# Altium schematic sheet schematic_industrial controller board.SchDoc: Industerial controller
size B; ApprovedBy: abbas; CheckedBy: abbas; Author: abbas; Revision: V1.0; SheetNumber: 1; SheetTotal: 1; Size: A4
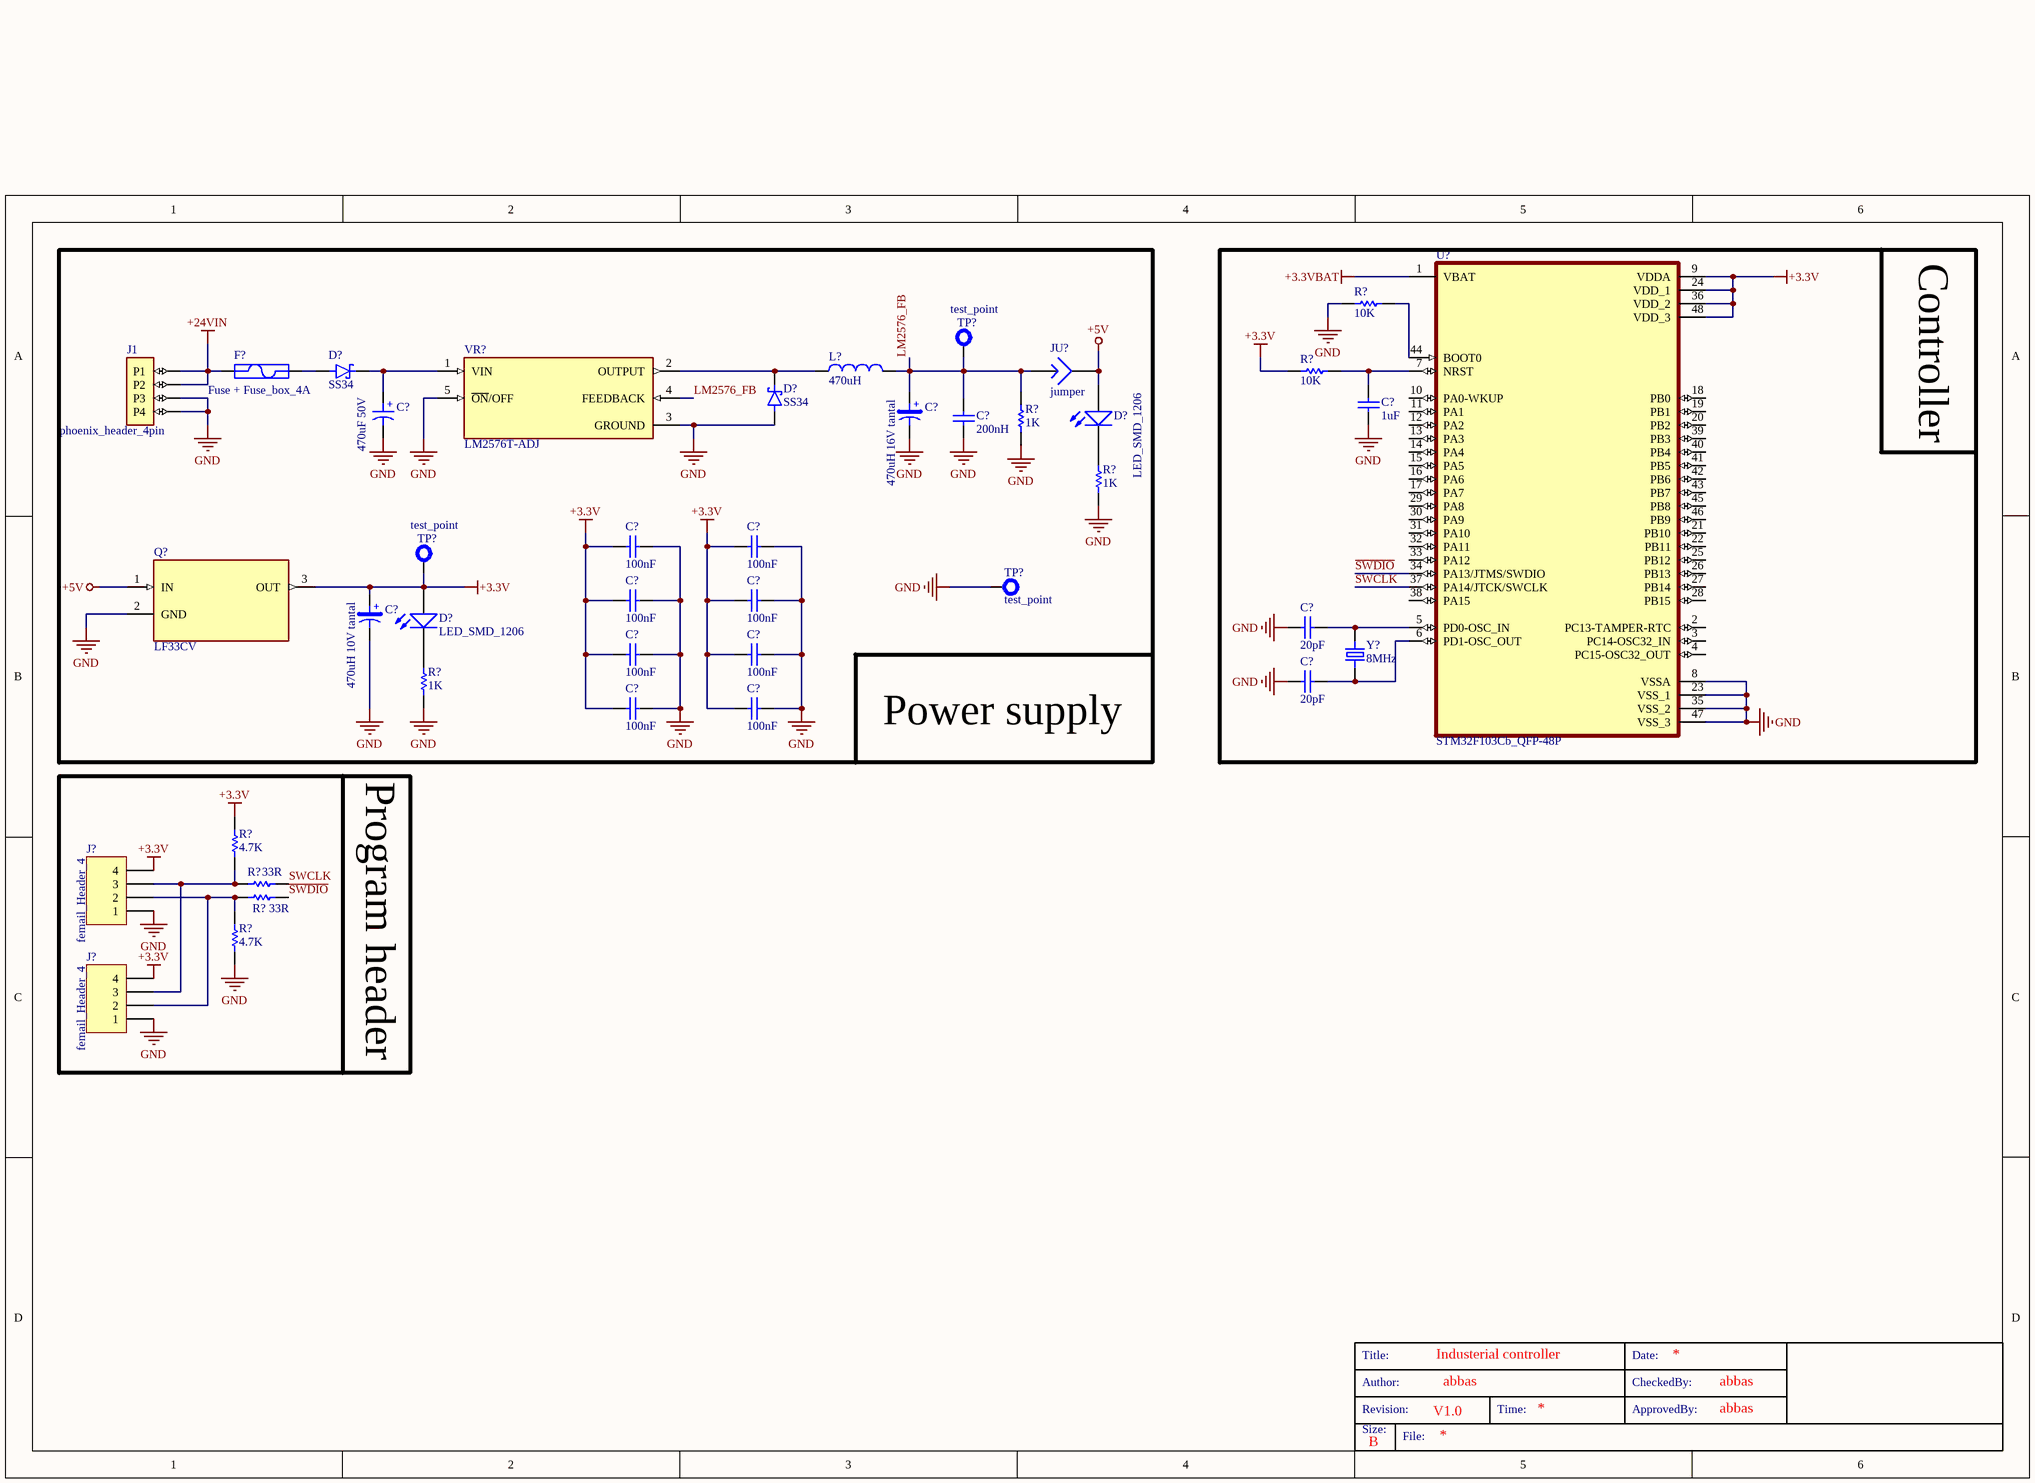
[diagram p0: schematic_industrial controller board.SchDoc]

## Parts
(Parts that share a designator on the sheet are numbered #1, #2 ... from top to bottom, then left to right.)
C?#1  1uF  [cap ceramic 1206]
C?#2  470uF 50V  [capacity]
C?#3  470uH 16V tantal  [Tantalium_cap_D size]
C?#4  200nH  [cap ceramic 1206]
C?#5  100nF  [cap ceramic 1206]
C?#6  100nF  [cap ceramic 1206]
C?#7  100nF  [cap ceramic 1206]
C?#8  100nF  [cap ceramic 1206]
C?#9  470uH 10V tantal  [Tantalium_cap_D size]
C?#10  20pF  [cap ceramic 1206]
C?#11  100nF  [cap ceramic 1206]
C?#12  100nF  [cap ceramic 1206]
C?#13  20pF  [cap ceramic 1206]
C?#14  100nF  [cap ceramic 1206]
C?#15  100nF  [cap ceramic 1206]
D?#1  SS34  [SS34_smd]
D?#2  SS34  [SS34_smd]
D?#3  LED_SMD_1206  [LED_SMD_1206]
D?#4  LED_SMD_1206  [LED_SMD_1206]
F?  Fuse + Fuse_box_4A  [Fuse_box]
J1  phoenix_header_4pin  [phoenix_header_4pin]
J?#1  femail_Header_4  [femail_Header_4pin]
J?#2  femail_Header_4  [femail_Header_4pin]
JU?  jumper  [jumper]
L?  470uH  [Indicator_DIP]
Q?  LF33CV  [LF33CV_TO220_3]
R?#1  10K  [resistor 1206]
R?#2  10K  [resistor 1206]
R?#3  1K  [resistor 1206]
R?#4  1K  [resistor 1206]
R?#5  1K  [resistor 1206]
R?#6  4.7K  [resistor 1206]
R?#7  33R  [resistor 1206]
R?#8  33R  [resistor 1206]
R?#9  4.7K  [resistor 1206]
TP?#1  test_point  [test_point]
TP?#2  test_point  [test_point]
TP?#3  test_point  [test_point]
U?  STM32F103Cb_QFP-48P  [STM32F103Cb_QFP-48P]
VR?  LM2576T-ADJ  [LM2576T-ADJ_TO220]
Y?  8MHz  [Crystal_HC-49US]

## Blocks framed on the sheet
Power supply: C?#2-C?#9 C?#11 C?#12 C?#14 C?#15 D?#1-D?#4 F? J1 JU? L? Q? R?#3-R?#5 TP?#1-TP?#3 VR?
Controller: C?#1 C?#10 C?#13 R?#1 R?#2 U? Y?
Program header: J?#1 J?#2 R?#6-R?#9

## Nets
+3.3V: C?#5.2 C?#6.2 C?#7.2 C?#8.2 C?#9.1 C?#11.2 C?#12.2 C?#14.2 C?#15.2 D?#4.2(A) J?#1.4 J?#2.4 Q?.3(OUT) R?#2.2 R?#6.1 TP?#2.1 U?.9(VDDA) U?.24(VDD_1) U?.36(VDD_2) U?.48(VDD_3)
+3.3VBAT: U?.1(VBAT)
+5V: D?#3.2(A) JU?.2 Q?.1(IN)
+24VIN: F?.1 J1.P1 J1.P2
GND: C?#1.2 C?#2.2 C?#3.2 C?#4.1 C?#5.1 C?#6.1 C?#7.1 C?#8.1 C?#9.2 C?#10.1 C?#11.1 C?#12.1 C?#13.1 C?#14.1 C?#15.1 D?#2.A J1.P3 J1.P4 J?#1.1 J?#2.1 Q?.2(GND) R?#1.2 R?#3.1 R?#4.1 R?#5.1 R?#9.2 TP?#3.1 U?.8(VSSA) U?.23(VSS_1) U?.35(VSS_2) U?.47(VSS_3) VR?.3(GROUND) VR?.5(~{ON}/OFF)
~{SWDIO}: R?#8.1 U?.34(PA13/JTMS/SWDIO)
LM2576_FB: C?#3.1 C?#4.2 JU?.1 L?.2 R?#3.2 TP?#1.1 VR?.4(FEEDBACK)
SWCLK: R?#7.2 U?.37(PA14/JTCK/SWCLK)
NetC?#1_1: C?#1.1 R?#2.1 U?.7(NRST)
NetC?#2_1: C?#2.1 D?#1.C(K) VR?.1(VIN)
NetC?#10_2: C?#10.2 U?.5(PD0-OSC_IN) Y?.1
NetC?#13_2: C?#13.2 U?.6(PD1-OSC_OUT) Y?.2
NetD?#1_A: D?#1.A F?.2
NetD?#2_C: D?#2.C(K) L?.1 VR?.2(OUTPUT)
NetD?#3_1: D?#3.1(K) R?#4.2
NetD?#4_1: D?#4.1(K) R?#5.2
NetJ?#1_2: J?#1.2 J?#2.2 R?#8.2 R?#9.1
NetJ?#1_3: J?#1.3 J?#2.3 R?#6.2 R?#7.1
NetR?#1_1: R?#1.1 U?.44(BOOT0)

Not connected (* = marked no-connect by the designer): U? 2(PC13-TAMPER-RTC) 3(PC14-OSC32_IN) 4(PC15-OSC32_OUT) 10(PA0-WKUP) 11(PA1) 12(PA2) 13(PA3) 14(PA4) 15(PA5) 16(PA6) 17(PA7) 18(PB0) 19(PB1) 20(PB2) 21(PB10) 22(PB11) 25(PB12) 26(PB13) 27(PB14) 28(PB15) 29(PA8) 30(PA9) 31(PA10) 32(PA11) 33(PA12) 38(PA15) 39(PB3) 40(PB4) 41(PB5) 42(PB6) 43(PB7) 45(PB8) 46(PB9)

## Notes on the sheet
- Title:
- Date:
- Size:
- Author:
- Revision:
- Time:
- CheckedBy:
- ApprovedBy:
- B
- File:
- (in symbol Cap electrolitic radial 6x7-2.5) +
- (in symbol tantalium_cap_D_size) +

## Library data of the parts
C?#1 C?#4-C?#8 C?#10-C?#15 = cap ceramic 1206
C?#2 = Cap electrolitic radial 6x7-2.5
C?#3 C?#9 = tantalium_cap_D_size
D?#1 D?#2 = SS34: SMD schottky diode
F? = Fuse_box
J1 = phoenix_header_4pin: Pluggable terminal block; socket; male; 3.5mm; angled 90Â°; ways: 4
J?#1 J?#2 = Header_4pin
L? = Indicator DIP
Q? = LF33CV: Linear Voltage Regulator IC Positive Fixed 1 Output 500mA TO-220
R?#1-R?#9 = Resistor 1206
U? = STM32F103Cb_QFP-48P: ARMÂ® CortexÂ®-M3 STM32F1 Microcontroller IC 32-Bit Single-Core 72MHz 128KB (128K x 8) FLASH
Y? = Crystal_HC-49US